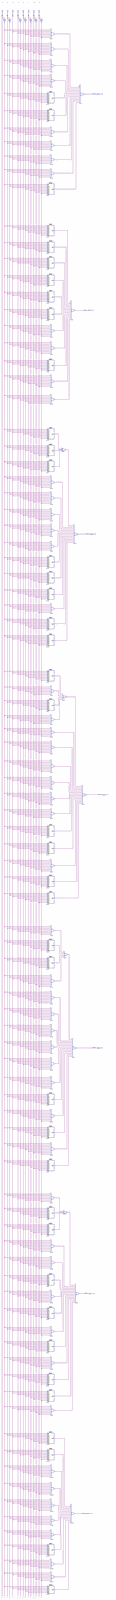
[diagram p0: schematic sheet, whole]
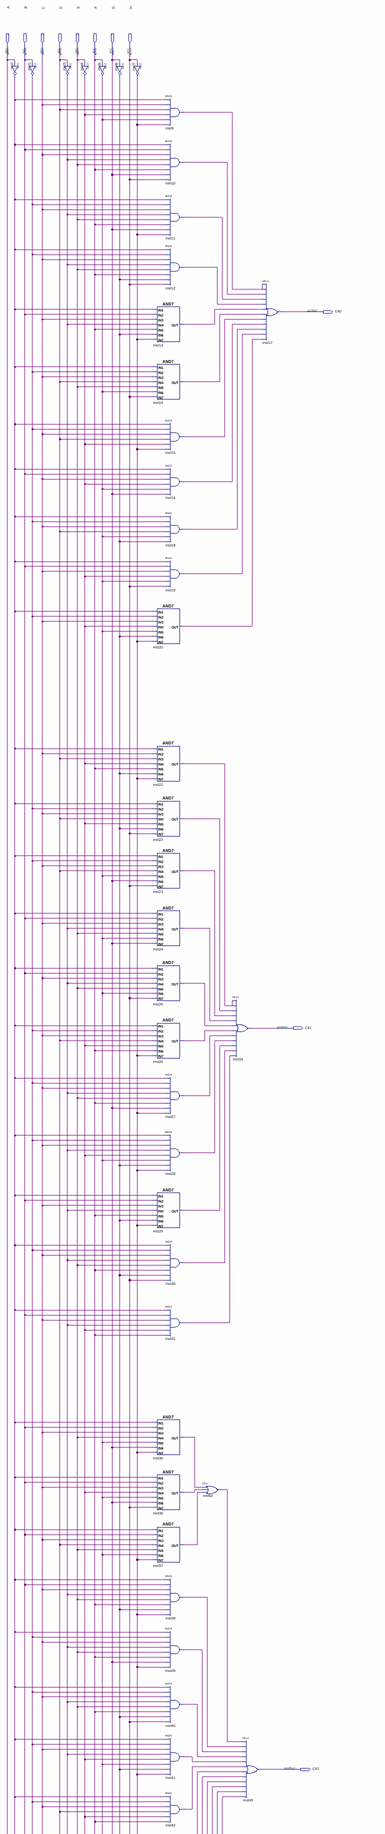
[diagram p1: schematic sheet, upper part]
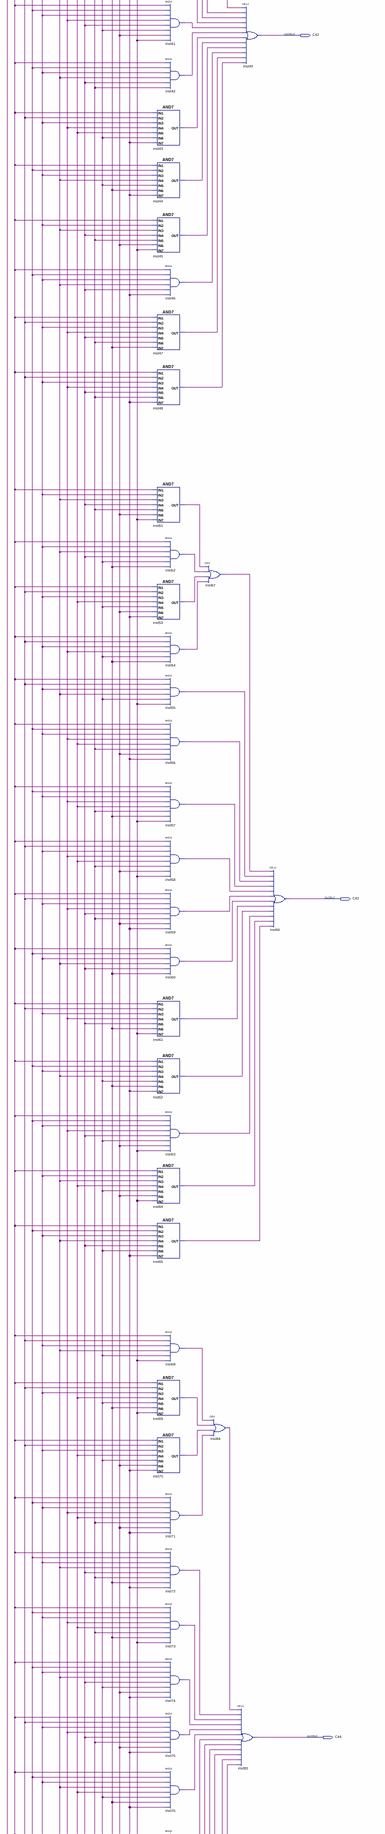
[diagram p2: schematic sheet, middle part]
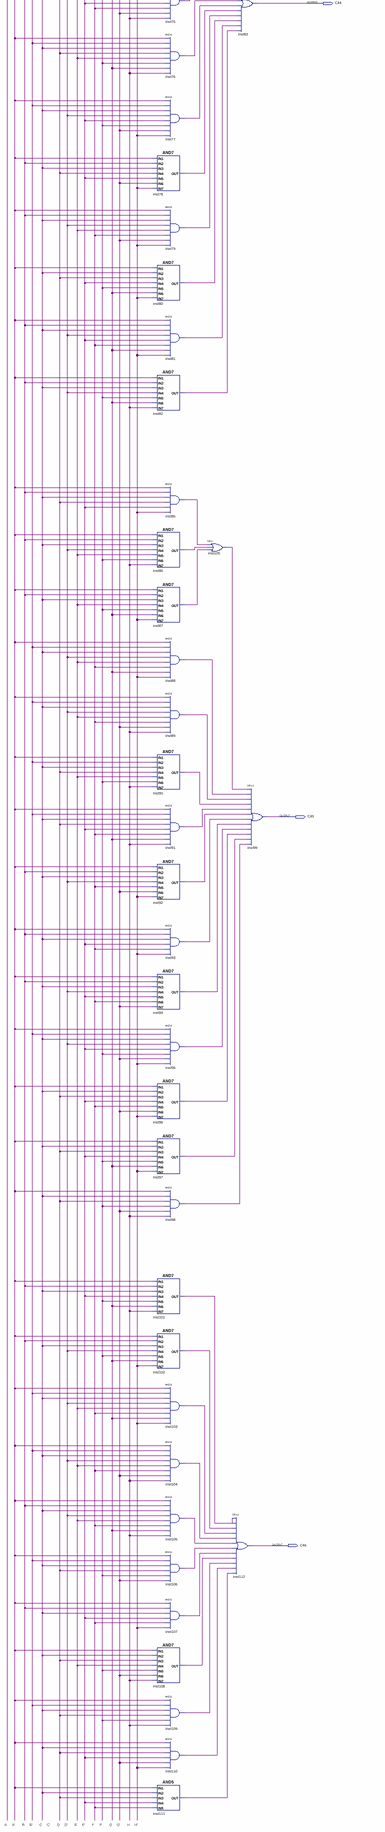
[diagram p3: schematic sheet, lower part]
// Quartus schematic matriz-coluna4.bdf as structural Verilog: 109 symbols, 15 pins
module \matriz-coluna4  (
  input  A,
  input  B,
  input  C,
  input  D,
  input  E,
  input  F,
  input  G,
  input  H,
  output C40,
  output C41,
  output C42,
  output C43,
  output C44,
  output C45,
  output C46
);

  wire inst1_out, inst3_out, inst4_out, inst5_out, inst6_out, inst7_out, inst9_out, inst10_out, inst11_out,
       inst12_out, inst13_out, inst14_out, inst15_out, inst16_out, inst18_out, inst19_out, inst20_out,
       inst21_out, inst22_out, inst23_out, inst24_out, inst25_out, inst26_out, inst27_out, inst28_out,
       inst29_out, inst30_out, inst31_out, inst35_out, inst36_out, inst37_out, inst38_out, inst39_out,
       inst40_out, inst41_out, inst42_out, inst43_out, inst44_out, inst45_out, inst46_out, inst47_out,
       inst48_out, inst50_out, inst51_out, inst52_out, inst53_out, inst54_out, inst55_out, inst56_out,
       inst57_out, inst58_out, inst59_out, inst60_out, inst61_out, inst62_out, inst63_out, inst64_out,
       inst65_out, inst67_out, inst68_out, inst69_out, inst70_out, inst71_out, inst72_out, inst73_out,
       inst74_out, inst75_out, inst76_out, inst77_out, inst78_out, inst79_out, inst80_out, inst81_out,
       inst82_out, inst84_out, inst85_out, inst86_out, inst87_out, inst88_out, inst89_out, inst90_out,
       inst91_out, inst92_out, inst93_out, inst94_out, inst95_out, inst96_out, inst97_out, inst98_out,
       inst100_out, inst101_out, inst102_out, inst103_out, inst104_out, inst105_out, inst106_out,
       inst107_out, inst108_out, inst109_out, inst110_out, inst111_out, inst_out;

  not inst (inst_out, A);
  not inst1 (inst1_out, B);
  not inst3 (inst3_out, D);
  not inst4 (inst4_out, E);
  not inst5 (inst5_out, F);
  not inst6 (inst6_out, G);
  not inst7 (inst7_out, H);
  and inst13 (inst13_out, inst_out, B, C, inst3_out, F, inst6_out, inst7_out);
  and inst14 (inst14_out, inst_out, inst1_out, C, D, E, inst5_out, H);
  and inst20 (inst20_out, inst_out, inst1_out, C, inst4_out, inst5_out, inst6_out, inst7_out);
  and inst21 (inst21_out, inst_out, C, D, inst4_out, F, inst6_out, inst7_out);
  and inst22 (inst22_out, inst_out, inst1_out, C, D, inst4_out, inst6_out, H);
  and inst23 (inst23_out, inst_out, inst1_out, C, D, inst5_out, G, H);
  and inst24 (inst24_out, inst_out, B, C, inst3_out, E, inst5_out, G);
  and inst25 (inst25_out, inst_out, B, C, inst3_out, E, inst5_out, H);
  and inst26 (inst26_out, inst_out, inst1_out, C, D, inst4_out, F, inst7_out);
  and inst29 (inst29_out, inst_out, B, C, inst3_out, F, inst6_out, inst7_out);
  and inst35 (inst35_out, inst_out, B, C, E, inst5_out, G, inst7_out);
  and inst36 (inst36_out, inst_out, B, C, inst4_out, inst5_out, G, H);
  and inst37 (inst37_out, inst_out, B, C, D, E, inst5_out, inst7_out);
  and inst43 (inst43_out, inst_out, B, C, inst3_out, E, inst5_out, H);
  and inst44 (inst44_out, inst_out, inst1_out, C, D, inst5_out, G, H);
  and inst45 (inst45_out, inst_out, C, D, inst4_out, F, inst6_out, inst7_out);
  and inst47 (inst47_out, inst_out, B, C, inst3_out, inst4_out, F, G);
  and inst48 (inst48_out, inst_out, B, C, inst3_out, inst4_out, F, H);
  and inst51 (inst51_out, inst_out, C, D, inst4_out, F, inst6_out, inst7_out);
  and inst53 (inst53_out, inst_out, B, C, E, inst5_out, inst6_out, H);
  and inst61 (inst61_out, inst_out, B, C, inst3_out, inst4_out, G, inst7_out);
  and inst62 (inst62_out, inst_out, inst1_out, C, D, inst5_out, G, H);
  and inst64 (inst64_out, inst_out, C, D, E, inst5_out, inst6_out, inst7_out);
  and inst65 (inst65_out, inst_out, inst1_out, C, D, inst4_out, inst5_out, H);
  and inst69 (inst69_out, inst_out, B, C, E, inst5_out, G, inst7_out);
  and inst70 (inst70_out, inst_out, B, C, E, inst5_out, inst6_out, H);
  and inst78 (inst78_out, inst_out, B, C, D, inst4_out, inst6_out, inst7_out);
  and inst80 (inst80_out, inst_out, C, D, inst4_out, inst5_out, G, inst7_out);
  and inst82 (inst82_out, inst_out, B, C, inst3_out, inst5_out, G, H);
  and inst86 (inst86_out, inst_out, B, C, inst3_out, E, inst5_out, H);
  and inst87 (inst87_out, inst_out, B, C, E, inst5_out, G, inst7_out);
  and inst90 (inst90_out, inst_out, inst1_out, C, D, E, inst5_out, H);
  and inst92 (inst92_out, inst_out, B, C, inst3_out, F, inst6_out, inst7_out);
  and inst94 (inst94_out, inst_out, B, C, inst3_out, inst4_out, F, inst6_out);
  and inst96 (inst96_out, inst_out, C, D, inst4_out, F, inst6_out, inst7_out);
  and inst97 (inst97_out, inst_out, C, D, inst4_out, inst5_out, G, inst7_out);
  and inst101 (inst101_out, inst_out, B, C, inst4_out, inst5_out, G, H);
  and inst102 (inst102_out, inst_out, B, C, inst3_out, inst5_out, G, inst7_out);
  and inst108 (inst108_out, inst_out, C, D, E, inst5_out, inst6_out, H);
  and inst111 (inst111_out, inst_out, C, D, inst4_out, F);
  and inst9 (inst9_out, inst_out, C, D, inst4_out, inst5_out, inst7_out);
  and inst10 (inst10_out, inst_out, B, C, inst3_out, E, F, G, H);
  and inst11 (inst11_out, inst_out, inst1_out, C, inst3_out, E, F, G, inst7_out);
  and inst12 (inst12_out, inst_out, inst1_out, C, inst3_out, E, F, inst6_out, H);
  and inst15 (inst15_out, inst_out, inst1_out, C, D, inst4_out, inst7_out);
  and inst16 (inst16_out, inst_out, B, C, inst4_out, inst5_out, G);
  and inst18 (inst18_out, inst_out, inst1_out, C, D, inst5_out, inst6_out);
  and inst19 (inst19_out, inst_out, B, C, inst4_out, inst5_out, H);
  and inst27 (inst27_out, inst_out, inst1_out, C, inst3_out, E, F, G, inst7_out);
  and inst28 (inst28_out, inst_out, inst1_out, C, inst3_out, inst4_out, inst5_out, inst6_out, inst7_out);
  and inst30 (inst30_out, inst_out, inst1_out, C, inst3_out, E, F, inst6_out, H);
  and inst31 (inst31_out, inst_out, B, C, inst3_out, inst4_out, F);
  and inst38 (inst38_out, inst_out, B, C, inst3_out, E, F, inst6_out, inst7_out);
  and inst39 (inst39_out, inst_out, inst1_out, C, inst3_out, E, F, G, inst7_out);
  and inst40 (inst40_out, inst_out, inst1_out, C, inst3_out, E, F, inst6_out, H);
  and inst41 (inst41_out, inst_out, inst1_out, C, inst3_out, inst4_out, inst5_out, inst6_out, inst7_out);
  and inst42 (inst42_out, inst_out, inst1_out, C, D, inst4_out, F);
  and inst46 (inst46_out, inst_out, inst1_out, C, D, inst4_out, H);
  and inst52 (inst52_out, inst_out, C, D, inst4_out, inst5_out, G);
  and inst54 (inst54_out, inst_out, B, C, inst3_out, inst5_out, G);
  and inst55 (inst55_out, inst_out, B, C, D, inst5_out, inst7_out);
  and inst56 (inst56_out, inst_out, inst1_out, C, inst3_out, E, F, inst6_out, H);
  and inst57 (inst57_out, inst_out, inst1_out, C, inst3_out, E, F, G, inst7_out);
  and inst58 (inst58_out, inst_out, B, C, inst3_out, E, F, inst6_out, inst7_out);
  and inst59 (inst59_out, inst_out, B, C, inst3_out, inst4_out, F, inst6_out, H);
  and inst60 (inst60_out, inst_out, inst1_out, C, D, inst4_out, G);
  and inst63 (inst63_out, inst_out, inst1_out, C, inst3_out, inst4_out, inst5_out, inst6_out, inst7_out);
  and inst68 (inst68_out, inst_out, B, C, D, inst5_out, inst7_out);
  and inst71 (inst71_out, inst_out, inst1_out, C, inst3_out, E, F, inst6_out, H);
  and inst72 (inst72_out, inst_out, inst1_out, C, D, inst4_out, F, G, H);
  and inst73 (inst73_out, inst_out, inst1_out, C, inst3_out, E, F, G, inst7_out);
  and inst74 (inst74_out, inst_out, inst1_out, C, D, inst4_out, inst5_out, inst6_out, H);
  and inst75 (inst75_out, inst_out, B, C, inst3_out, inst4_out, F, inst6_out, H);
  and inst76 (inst76_out, inst_out, inst1_out, C, D, E, inst5_out, G, H);
  and inst77 (inst77_out, inst_out, inst1_out, C, inst3_out, inst4_out, inst5_out, inst6_out, inst7_out);
  and inst79 (inst79_out, inst_out, B, C, inst3_out, E, F, inst6_out, inst7_out);
  and inst81 (inst81_out, inst_out, B, C, inst3_out, inst4_out, F, G, inst7_out);
  and inst85 (inst85_out, inst_out, B, C, D, inst4_out, inst7_out);
  and inst88 (inst88_out, inst_out, inst1_out, C, inst3_out, E, F, G, inst7_out);
  and inst89 (inst89_out, inst_out, inst1_out, C, inst3_out, E, F, inst6_out, H);
  and inst91 (inst91_out, inst_out, inst1_out, C, D, inst4_out, F, G, H);
  and inst93 (inst93_out, inst_out, B, C, inst4_out, F, inst7_out);
  and inst95 (inst95_out, inst_out, inst1_out, C, inst3_out, inst4_out, inst5_out, inst6_out, inst7_out);
  and inst98 (inst98_out, inst_out, C, D, inst5_out, inst6_out, H);
  and inst103 (inst103_out, inst_out, inst1_out, C, inst3_out, E, F, G, inst7_out);
  and inst104 (inst104_out, inst_out, inst1_out, C, inst3_out, E, F, inst6_out, H);
  and inst105 (inst105_out, inst_out, B, C, inst3_out, E, F, G, H);
  and inst106 (inst106_out, inst_out, inst1_out, C, D, inst5_out, inst6_out);
  and inst107 (inst107_out, inst_out, B, C, inst4_out, F, inst7_out);
  and inst109 (inst109_out, inst_out, inst1_out, C, D, inst5_out, H);
  and inst110 (inst110_out, inst_out, C, D, inst4_out, inst6_out, inst7_out);
  or inst50 (inst50_out, inst35_out, inst36_out, inst37_out);
  or inst67 (inst67_out, inst51_out, inst52_out, inst53_out, inst54_out);
  or inst84 (inst84_out, inst68_out, inst69_out, inst70_out, inst71_out);
  or inst100 (inst100_out, inst85_out, inst86_out, inst87_out);
  or inst34 (C41, inst21_out, inst21_out, inst22_out, inst23_out, inst24_out, inst25_out, inst26_out, inst27_out, inst28_out, inst29_out, inst30_out, inst31_out);
  or inst112 (C46, inst101_out, inst101_out, inst102_out, inst103_out, inst104_out, inst105_out, inst106_out, inst107_out, inst108_out, inst109_out, inst110_out, inst111_out);
  or inst49 (C42, inst50_out, inst38_out, inst39_out, inst40_out, inst41_out, inst42_out, inst43_out, inst44_out, inst45_out, inst46_out, inst47_out, inst48_out);
  or inst83 (C44, inst84_out, inst72_out, inst73_out, inst74_out, inst75_out, inst76_out, inst77_out, inst78_out, inst79_out, inst80_out, inst81_out, inst82_out);
  or inst99 (C45, inst100_out, inst88_out, inst89_out, inst90_out, inst91_out, inst92_out, inst93_out, inst94_out, inst95_out, inst96_out, inst97_out, inst98_out);
  or inst17 (C40, inst9_out, inst9_out, inst10_out, inst11_out, inst12_out, inst13_out, inst14_out, inst15_out, inst16_out, inst18_out, inst19_out, inst20_out);
  or inst66 (C43, inst67_out, inst55_out, inst56_out, inst57_out, inst58_out, inst59_out, inst60_out, inst61_out, inst62_out, inst63_out, inst64_out, inst65_out);

  // Notes on the sheet:
  //   A
  //   A'
  //   B
  //   B'
  //   C
  //   C'
  //   D
  //   D'
  //   E
  //   E'
  //   F
  //   F'
  //   G
  //   G'
  //   H
  //   H'
endmodule
